# Altium schematic sheet MEMS&RF.SchDoc
size A4
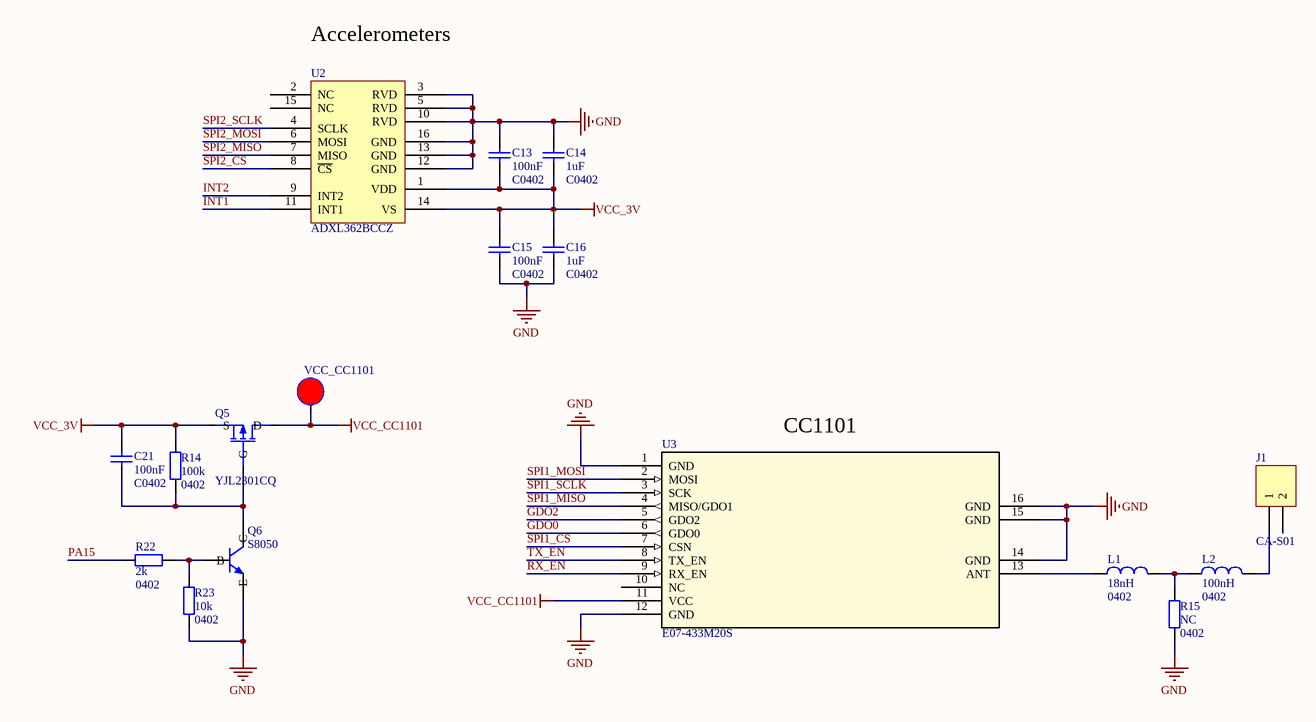
[diagram p0: MEMS&RF.SchDoc]

## Parts
C13  100nF  PackageReference: C0402  [0402]
C14  1uF  PackageReference: C0402  [0402]
C15  100nF  PackageReference: C0402  [0402]
C16  1uF  PackageReference: C0402  [0402]
C21  100nF  PackageReference: C0402  [0402]
J1  CA-S01  [CA-S01]
L1  18nH  [0402]
L2  100nH  [0402]
Q5  YJL2301CQ  [SOT95P237X112-3N]
Q6  S8050  [SOT-23B_N]
R14  100k  PackageReference: 0402  [RESC1005X04N]
R15  NC  PackageReference: 0402  [RESC1005X04N]
R22  2k  PackageReference: 0402  [RESC1005X04N]
R23  10k  PackageReference: 0402  [RESC1005X04N]
U2  ADXL362BCCZ  [LGA_CC-16-4]
U3  E07-433M20S  [PE07-433M20S]
VCC_CC1101  TP-EMB-SMT-Single-20mil-1pin  [EMB-SMT-40MILX40MIL]  (value not drawn)

## Nets
GND: C13.2 C14.2 C15.2 C16.1 Q6.E R15.1 R23.1 U2.3(RVD) U2.5(RVD) U2.10(RVD) U2.12(GND) U2.13(GND) U2.16(GND) U3.1(GND) U3.12(GND) U3.14(GND) U3.15(GND) U3.16(GND)
VCC_3V: C13.1 C14.1 C15.1 C16.2 C21.1 Q5.2(S) R14.2 U2.1(VDD) U2.14(VS)
VCC_CC1101: Q5.3(D) U3.11(VCC) VCC_CC1101.1
GDO0: U3.6(GDO0)
GDO2: U3.5(GDO2)
INT1: U2.11(INT1)
INT2: U2.9(INT2)
PA15: R22.1
RX_EN: U3.9(RX_EN)
SPI1_CS: U3.7(CSN)
SPI1_MISO: U3.4(MISO/GDO1)
SPI1_MOSI: U3.2(MOSI)
SPI1_SCLK: U3.3(SCK)
SPI2_CS: U2.8(~{CS})
SPI2_MISO: U2.7(MISO)
SPI2_MOSI: U2.6(MOSI)
SPI2_SCLK: U2.4(SCLK)
TX_EN: U3.8(TX_EN)
NetC21_2: C21.2 Q5.1(G) Q6.C R14.1
NetJ1_1: J1.1 L2.2
NetL1_1: L1.1 U3.13(ANT)
NetL1_2: L1.2 L2.1 R15.2
NetQ6_B: Q6.B R22.2 R23.2

Not connected (* = marked no-connect by the designer): J1 2; U2 2(NC) 15(NC); U3 10(NC)

## Notes on the sheet
- (near U2) Accelerometers
- (near U3) CC1101

## Library data of the parts
C13 C15 C21 = GRM155R71H104KE14: Capacitor (0402,X7R,100nF,DC 50V,±10%) Murata; Published: 8-Jun-2000; LatestRevisionDate: 29-May-2009; LatestRevisionNote: IPC-7351 Footprint Added.; Publisher: Altium Limited; PackageDescription: Chip Capacitor; Value: 100nF
C14 C16 = GRM155R61E105KE11: Capacitor (0402,X5R,1uF,DC 25V,±10%) Murata; Published: 8-Jun-2000; LatestRevisionDate: 29-May-2009; LatestRevisionNote: IPC-7351 Footprint Added.; Publisher: Altium Limited; PackageDescription: Chip Capacitor; Value: 1uF
J1 = CA-S01: CrossAir Antenna，广州寒武纪电子科技有限公司; LatestRevisionDate: 17-Jul-2002; LatestRevisionNote: Re-released for DXP Platform.; Publisher: Altium Limited
L1 = LQW15AN18NJ00: Inductor, 18n, 0402, ±5%, wire-wound type Murata; Published: 8-Jun-2000; LatestRevisionDate: 29-May-2009; LatestRevisionNote: IPC-7351 Footprint Added.; Publisher: Altium Limited; PackageDescription: Inductor; Value: 18nH; PackageReference: 0402
L2 = LQW15ANR10J00: Inductor, 100n, 0402, ±5%, wire-wound type Murata; Published: 8-Jun-2000; LatestRevisionDate: 29-May-2009; LatestRevisionNote: IPC-7351 Footprint Added.; Publisher: Altium Limited; PackageDescription: Inductor; Value: 100nH; PackageReference: 0402
Q5 = YJL2301CQ: P-Channel Enhancement Mode Field Effect Transistor, VDS=-20V, VGS=±10V, ID=-3.4A, VGS(th)Min=-0.4V, SOT-23, YANGJIE; Published: 8-Jun-2000; LatestRevisionDate: 17-Jul-2002; LatestRevisionNote: Re-released for DXP Platform.; PackageVersion: 1995/1996; PackageReference: SOT23; Publisher: Altium Limited; PackageDescription: SOT23, 3-Leads, Body 2.92x2.37mm, Pitch 0.95mm, IPC Medium Density
Q6 = S8050: NPN General Purpose Amplifier, -55 to +150°C; Manufacturer: 扬州扬杰电子科技股份有限公司; VCBO(V): 40; VCEO(V): 25; VEBO(V): 5; IC(mA): 500; PC(mW): 300; Package: SOT-23
R14 = RC0402FR-07100KL: Resistor 0402(1005) 100kΩ ±1%; PackageDescription: Chip Resistor, 2-Leads, Body 1.00x0.50mm, IPC Medium Density; Value: 100k
R15 = RC0402JR: Resistor 0402(1005) 0Ω; PackageDescription: Chip Resistor, 2-Leads, Body 1.00x0.50mm, IPC Medium Density; Value: NC
R22 = RC0402FR-072KL: Resistor 0402(1005) 2kΩ ±1%; PackageDescription: Chip Resistor, 2-Leads, Body 1.00x0.50mm, IPC Medium Density; Value: 2k
R23 = RC0402FR-0710KL: Resistor 0402(1005) 10kΩ ±1%; PackageDescription: Chip Resistor, 2-Leads, Body 1.00x0.50mm, IPC Medium Density; Value: 10k
U2 = ADXL362BCCZ: ADXL362, LGA, CC-16-4.
U3 = E07-433M20S: E07-433M20S是基于美国原装进口CC1101由成都亿佰特设计生产的大功率CC1101无线模块，默认发射功率为100mW、内置PA的模块，做到了功耗与性能的平衡。SPI接口，收发一体，可以工作在433MHz主流ISM频段，支持开发低功耗，目前已经多种场景中广泛应用; Isupply(uA): 2; Vin(V): 2.1-3.6; Iout(max)(mA): 100; frequency(MHz): 433
VCC_CC1101 = TP-EMB-SMT-Single-20mil-1pin: Test Point Designed for holding a standard probe lead